# Altium schematic sheet WBR3-CS1239 V1.0.SchDoc
size A2; Parameter 1: 1.5C
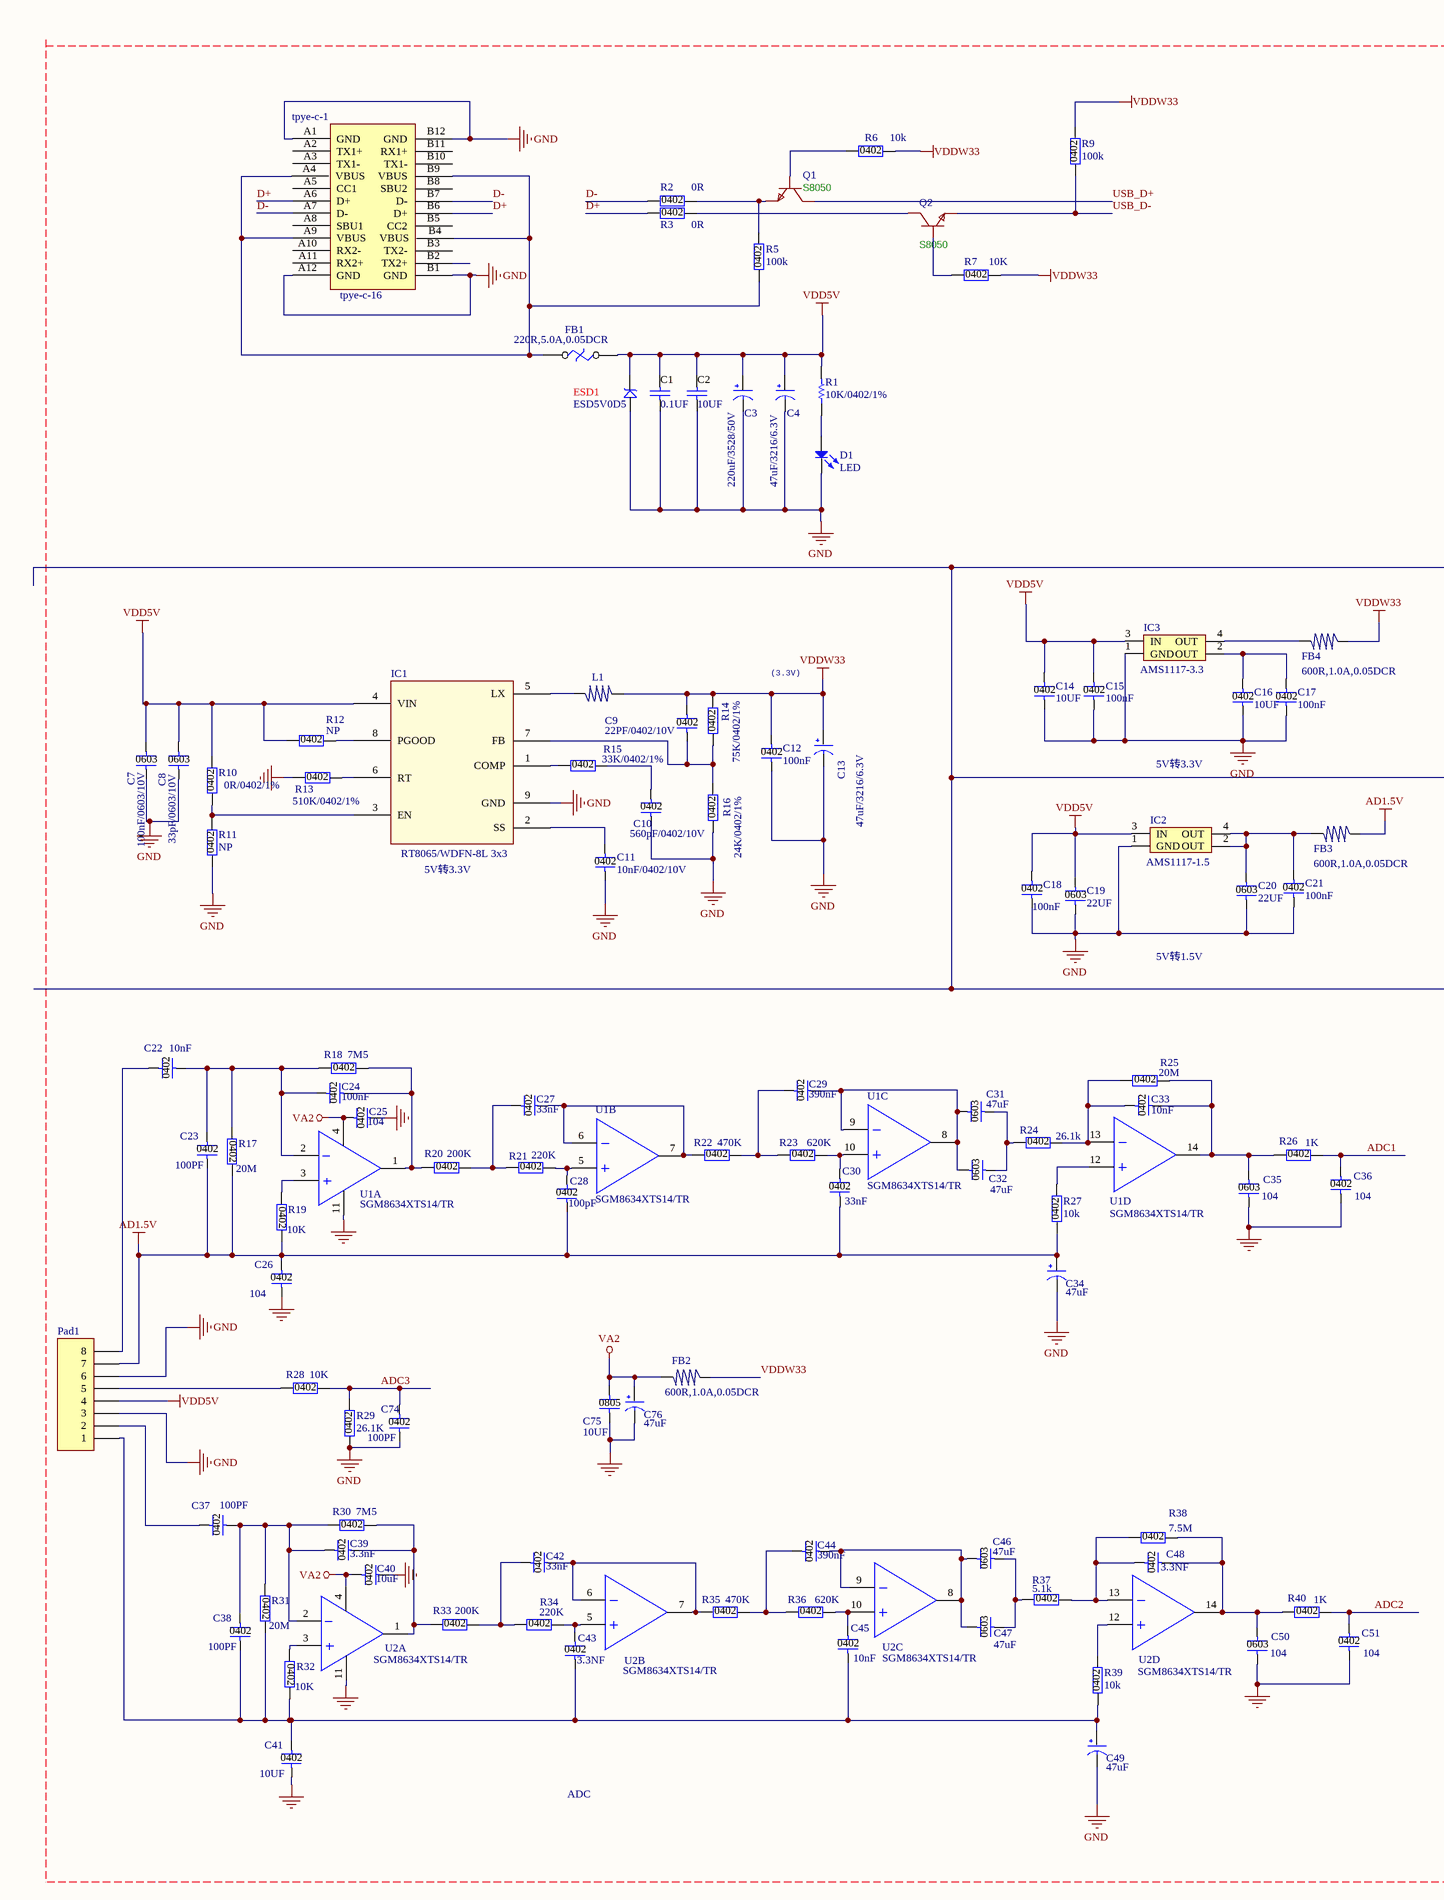
[diagram p0: WBR3-CS1239 V1.0.SchDoc, left]
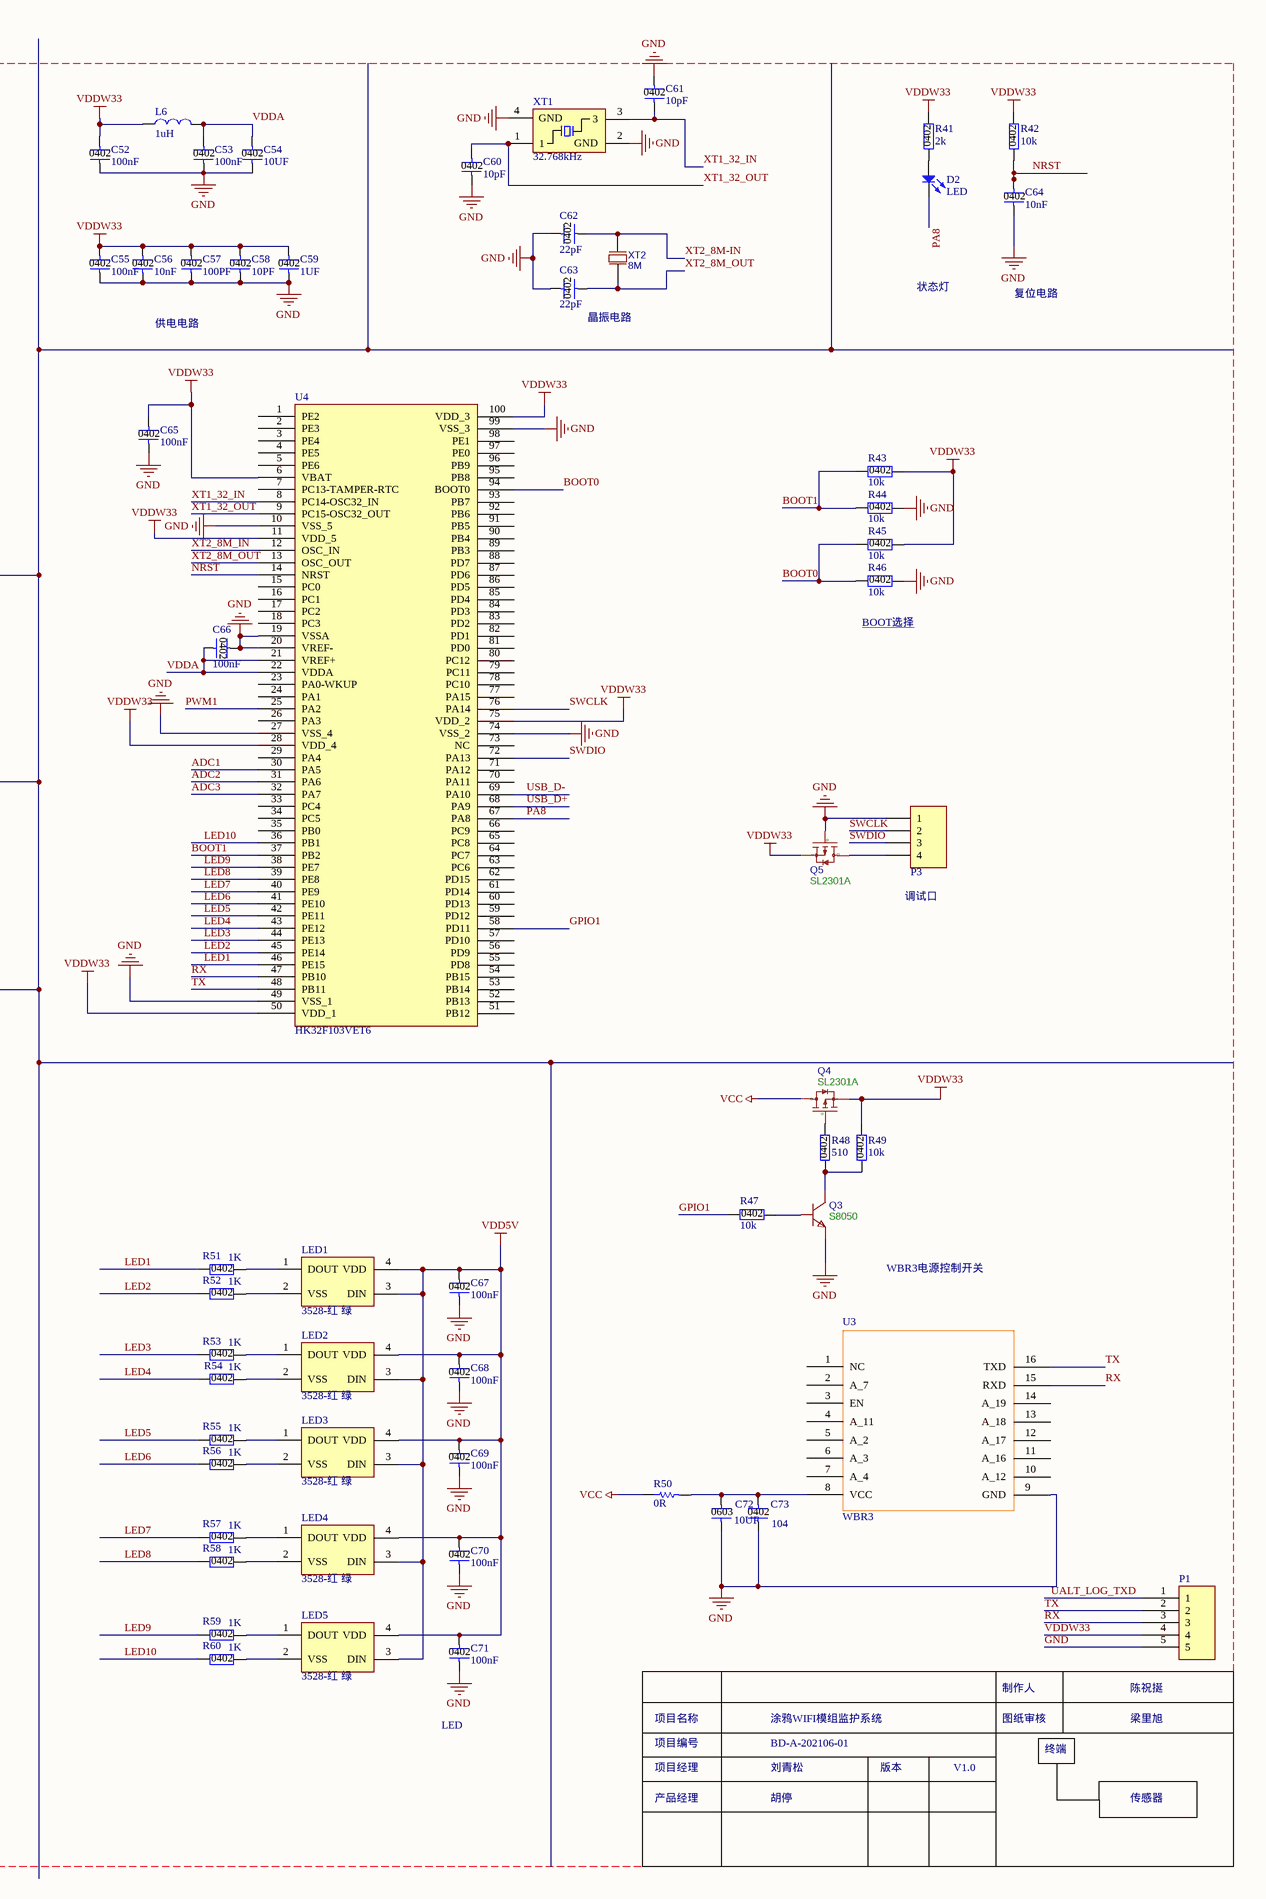
[diagram p1: WBR3-CS1239 V1.0.SchDoc, right]

## Parts
C1  0.1UF  [C0603]
C2  10UF  [C0603]
C3  220uF/3528/50V  [CCAPE-D]
C4  47uF/3216/6.3V  [TAJ-A]
C7  100nF/0603/10V  [C0603]
C8  33pF/0603/10V  [C0603]
C9  22PF/0402/10V  [C0402]
C10  560pF/0402/10V  [C0402]
C11  10nF/0402/10V  [C0402]
C12  100nF  [C0402]
C13  47uF/3216/6.3V  [TAJ-A]
C14  10UF  [C0402]
C15  100nF  [C0402]
C16  10UF  [C0402]
C17  100nF  [C0402]
C18  100nF  [C0402]
C19  22UF  [C0402]
C20  22UF  [C0402]
C21  100nF  [C0402]
C22  10nF  [C0402]
C23  100PF  [C0402]
C24  100nF  [C0402]
C25  104  [C0402]
C26  104  [C0402]
C27  33nF  [C0402]
C28  100pF  [C0402]
C29  390nF  [C0402]
C30  33nF  [C0402]
C31  47uF  [C0603]
C32  47uF  [C0603]
C33  10nF  [C0402]
C34  47uF  [TAJ-A]
C35  104  [C0603]
C36  104  [C0402]
C37  100PF  [C0402]
C38  100PF  [C0402]
C39  3.3nF  [C0402]
C40  10uF  [C0402]
C41  10UF  [C0402]
C42  33nF  [C0402]
C43  3.3NF  [C0402]
C44  390nF  [C0402]
C45  10nF  [C0402]
C46  47uF  [C0603]
C47  47uF  [C0603]
C48  3.3NF  [C0402]
C49  47uF  [TAJ-A]
C50  104  [C0603]
C51  104  [C0402]
C52  100nF  [C0402]
C53  100nF  [C0402]
C54  10UF  [C0402]
C55  100nF  [C0402]
C56  10nF  [C0402]
C57  100PF  [C0402]
C58  10PF  [C0402]
C59  1UF  [C0402]
C60  10pF  [C0402]
C61  10pF  [C0402]
C62  22pF  [C0402]
C63  22pF  [C0402]
C64  10nF  [C0402]
C65  100nF  [C0402]
C66  100nF  [C0402]
C67  100nF  [C0402]
C68  100nF  [C0402]
C69  100nF  [C0402]
C70  100nF  [C0402]
C71  100nF  [C0402]
C72  10UF  [C0603]
C73  104  [C0402]
C74  100PF  [C0402]
C75  10UF  [C0805]
C76  47uF  [TAJ-A]
D1  LED  [LED0805]
D2  LED  [LED0805]
ESD1  ESD5V0D5  [SMBJ5]
FB1  220R,5.0A,0.05DCR  [FB]
FB2  600R,1.0A,0.05DCR  [R0805]
FB3  600R,1.0A,0.05DCR  [R0805]
FB4  600R,1.0A,0.05DCR  [R0805]
IC1  RT8065/WDFN-8L 3x3  [WDFM]
IC2  AMS1117-1.5  [3.3V]
IC3  AMS1117-3.3  [3.3V]
L1  220R,2.0A,0.05DCR  [L2*2]  (value not drawn)
L6  1uH  [R0402]
LED1  3528-红 绿  [LED]
LED2  3528-红 绿  [LED]
LED3  3528-红 绿  [LED]
LED4  3528-红 绿  [LED]
LED5  3528-红 绿  [LED]
P1  (no value)
P3  Header 4  [HDR1X4]  (value not drawn)
Pad1  Header 8  [PJ12]  (value not drawn)
Q1  S8050  [SOT-23-3L]
Q2  S8050  [SOT-23-3L]
Q3  S8050  [SOT-23-3L]
Q4  SL2301A  [SOT-23R]
Q5  SL2301A  [SOT-23R]
R1  10K/0402/1%  [0402]
R2  0R  [R0402]
R3  0R  [R0402]
R5  100k  [R0402]
R6  10k  [R0402]
R7  10K  [R0402]
R9  100k  [R0402]
R10  0R/0402/1%  [R0402]
R11  NP  [R0402]
R12  NP  [R0402]
R13  510K/0402/1%  [R0402]
R14  75K/0402/1%  [R0402]
R15  33K/0402/1%  [R0402]
R16  24K/0402/1%  [R0402]
R17  20M  [R0402]
R18  7M5  [R0402]
R19  10K  [R0402]
R20  200K  [R0402]
R21  220K  [R0402]
R22  470K  [R0402]
R23  620K  [R0402]
R24  26.1k  [R0402]
R25  20M  [R0402]
R26  1K  [R0402]
R27  10k  [R0402]
R28  10K  [R0402]
R29  26.1K  [R0402]
R30  7M5  [R0402]
R31  20M  [R0402]
R32  10K  [R0402]
R33  200K  [R0402]
R34  220K  [R0402]
R35  470K  [R0402]
R36  620K  [R0402]
R37  5.1k  [R0402]
R38  7.5M  [R0402]
R39  10k  [R0402]
R40  1K  [R0402]
R41  2k  [R0402]
R42  10k  [R0402]
R43  10k  [R0402]
R44  10k  [R0402]
R45  10k  [R0402]
R46  10k  [R0402]
R47  10k  [R0402]
R48  510  [R0402]
R49  10k  [R0402]
R50  0R  [0402]
R51  1K  [R0402]
R52  1K  [R0402]
R53  1K  [R0402]
R54  1K  [R0402]
R55  1K  [R0402]
R56  1K  [R0402]
R57  1K  [R0402]
R58  1K  [R0402]
R59  1K  [R0402]
R60  1K  [R0402]
tpye-c-1  tpye-c-16  [TYPE-C_16P_SMT]
U1  SGM8634XTS14/TR  [SSOP-14]  (parts A,B,C,D of 4)
U2  SGM8634XTS14/TR  [SSOP-14]  (parts A,B,C,D of 4)
U3  WBR3
U4  HK32F103VET6
XT1  32.768kHz  [y1]
XT2  8M  [y2]

## Nets
AD1.5V: C23.2 C26.1 C28.2 C30.2 C34.1(VCC) FB3.1 Pad1.7 R17.2 R19.2 R27.1
GND: C1.1 C2.2 C3.2(GND) C4.2(GND) C7.2 C8.2 C10.2 C11.2 C12.2 C13.2(GND) C14.2 C15.2 C16.2 C17.2 C18.2 C19.2 C20.2 C21.2 C25.2 C26.2 C34.2(GND) C35.2 C36.2 C40.2 C41.2 C49.2(GND) C50.2 C51.2 C52.2 C53.2 C54.2 C55.2 C56.2 C57.2 C58.2 C59.2 C60.2 C61.1 C62.1 C63.1 C64.2 C65.2 C66.1 C67.2 C68.2 C69.2 C70.2 C71.2 C72.2 C73.2 C74.2 C75.2 C76.2(GND) D1.2(K) ESD1.1 IC1.9(GND) IC2.1(GND) IC3.1(GND) P1.5 P3.1 Pad1.3 Pad1.6 Q3.1(E) Q5.1(G) R11.1 R13.1 R16.1 R29.1 R44.2 R46.2 tpye-c-1.A1(GND) tpye-c-1.A12(GND) tpye-c-1.B1(GND) tpye-c-1.B12(GND) U1.11 U2.11 U3.9(GND) U4.10(VSS_5) U4.19(VSSA) U4.20(VREF-) U4.27(VSS_4) U4.49(VSS_1) U4.74(VSS_2) U4.99(VSS_3) XT1.2(GND) XT1.4(GND)
VA2: C25.1 C40.1 C75.1 C76.1(VCC) FB2.2 U1.4 U2.4
VCC: Q4.3(D) R50.1
VDD5V: C1.2 C2.1 C3.1(VCC) C4.1(VCC) C7.1 C8.1 C14.1 C15.1 C18.1 C19.1 C67.1 C68.1 C69.1 C70.1 C71.1 ESD1.2 FB1.2 IC1.4(VIN) IC2.3(IN) IC3.3(IN) LED1.3(DIN) LED1.4(VDD) LED2.3(DIN) LED2.4(VDD) LED3.3(DIN) LED3.4(VDD) LED4.3(DIN) LED4.4(VDD) LED5.3(DIN) LED5.4(VDD) Pad1.4 R1.2 R10.2 R12.1
VDDW33: C9.1 C12.1 C13.1(VCC) C52.1 C55.1 C56.1 C57.1 C58.1 C59.1 C65.1 FB2.1 FB4.1 L1.2 L6.2 P1.4 Q4.2(S) Q5.2(S) R6.2 R7.2 R9.2 R14.2 R41.2 R42.2 R43.2 R45.2 R49.2 U4.6(VBAT) U4.11(VDD_5) U4.28(VDD_4) U4.50(VDD_1) U4.75(VDD_2) U4.100(VDD_3)
ADC1: C36.1 R26.2 U4.30(PA5)
ADC2: C51.1 R40.2 U4.31(PA6)
ADC3: C74.1 R28.2 R29.2 U4.32(PA7)
BOOT0: R45.1 R46.1 U4.94(BOOT0)
BOOT1: R43.1 R44.1 U4.37(PB2)
D+: R3.1 tpye-c-1.A6(D+) tpye-c-1.B6(D+)
D-: R2.1 tpye-c-1.A7(D-) tpye-c-1.B7(D-)
GPIO1: R47.1 U4.58(PD11)
LED1: R51.1 U4.46(PE15)
LED2: R52.1 U4.45(PE14)
LED3: R53.1 U4.44(PE13)
LED4: R54.1 U4.43(PE12)
LED5: R55.1 U4.42(PE11)
LED6: R56.1 U4.41(PE10)
LED7: R57.1 U4.40(PE9)
LED8: R58.1 U4.39(PE8)
LED9: R59.1 U4.38(PE7)
LED10: R60.1 U4.36(PB1)
NRST: C64.1 R42.1 U4.14(NRST)
PA8: D2.2(K) U4.67(PA8)
PWM1: U4.25(PA2)
RX: P1.3 U3.15(RXD) U4.47(PB10)
SWCLK: P3.2 U4.76(PA14)
SWDIO: P3.3 U4.72(PA13)
TX: P1.2 U3.16(TXD) U4.48(PB11)
UALT_LOG_TXD: P1.1
USB_D+: Q1.3(C) U4.68(PA9)
USB_D-: Q2.1(E) R9.1 U4.69(PA10)
VDDA: C53.1 C54.1 C66.2 L6.1 U4.21(VREF+) U4.22(VDDA)
XT1_32_IN: C61.2 U4.8(PC14-OSC32_IN) XT1.3
XT1_32_OUT: C60.1 U4.9(PC15-OSC32_OUT) XT1.1
XT2_8M-IN: C62.2 XT2.2(OSC2)
XT2_8M_IN: U4.12(OSC_IN)
XT2_8M_OUT: C63.2 U4.13(OSC_OUT) XT2.1(OSC1)
NetC9_2: C9.2 IC1.7(FB) R14.1 R16.2
NetC10_1: C10.1 R15.2
NetC11_1: C11.1 IC1.2(SS)
NetC16_1: C16.1 C17.1 IC3.2(OUT)
NetC20_1: C20.1 C21.1 FB3.2 IC2.2(OUT) IC2.4(OUT)
NetC22_1: C22.1 Pad1.8
NetC22_2: C22.2 C23.1 C24.1 R17.1 R18.1 U1.2
NetC24_2: C24.2 R18.2 R20.1 U1.1
NetC27_1: C27.1 R20.2 R21.1
NetC27_2: C27.2 R22.1 U1.6 U1.7
NetC28_1: C28.1 R21.2 U1.5
NetC29_1: C29.1 R22.2 R23.1
NetC29_2: C29.2 C31.1 C32.1 U1.8 U1.9
NetC30_1: C30.1 R23.2 U1.10
NetC31_2: C31.2 C32.2 R24.1
NetC33_1: C33.1 R24.2 R25.1 U1.13
NetC33_2: C33.2 C35.1 R25.2 R26.1 U1.14
NetC37_1: C37.1 Pad1.2
NetC37_2: C37.2 C38.1 C39.1 R30.1 R31.1 U2.2
NetC38_2: C38.2 C41.1 C43.2 C45.2 C49.1(VCC) Pad1.1 R31.2 R32.2 R39.1
NetC39_2: C39.2 R30.2 R33.1 U2.1
NetC42_1: C42.1 R33.2 R34.1
NetC42_2: C42.2 R35.1 U2.6 U2.7
NetC43_1: C43.1 R34.2 U2.5
NetC44_1: C44.1 R35.2 R36.1
NetC44_2: C44.2 C46.1 C47.1 U2.8 U2.9
NetC45_1: C45.1 R36.2 U2.10
NetC46_2: C46.2 C47.2 R37.1
NetC48_1: C48.1 R37.2 R38.1 U2.13
NetC48_2: C48.2 C50.1 R38.2 R40.1 U2.14
NetC72_1: C72.1 C73.1 R50.2 U3.8(VCC)
NetD1_1: D1.1(A) R1.1
NetD2_1: D2.1(A) R41.1
NetFB1_1: FB1.1 R5.1 tpye-c-1.A4(VBUS) tpye-c-1.A9(VBUS) tpye-c-1.B4(VBUS) tpye-c-1.B9(VBUS)
NetFB4_2: FB4.2 IC3.4(OUT)
NetIC1_1: IC1.1(COMP) R15.1
NetIC1_3: IC1.3(EN) R10.1 R11.2
NetIC1_5: IC1.5(LX) L1.1
NetIC1_6: IC1.6(RT) R13.2
NetIC1_8: IC1.8(PGOOD) R12.2
NetLED1_1: LED1.1(DOUT) R51.2
NetLED1_2: LED1.2(VSS) R52.2
NetLED2_1: LED2.1(DOUT) R53.2
NetLED2_2: LED2.2(VSS) R54.2
NetLED3_1: LED3.1(DOUT) R55.2
NetLED3_2: LED3.2(VSS) R56.2
NetLED4_1: LED4.1(DOUT) R57.2
NetLED4_2: LED4.2(VSS) R58.2
NetLED5_1: LED5.1(DOUT) R59.2
NetLED5_2: LED5.2(VSS) R60.2
NetP3_4: P3.4 Q5.3(D)
NetPad1_5: Pad1.5 R28.1
NetQ1_1: Q1.1(E) R2.2 R5.2
NetQ1_2: Q1.2(B) R6.1
NetQ2_2: Q2.2(B) R7.1
NetQ2_3: Q2.3(C) R3.2
NetQ3_2: Q3.2(B) R47.2
NetQ3_3: Q3.3(C) R48.1 R49.1
NetQ4_1: Q4.1(G) R48.2
NetR19_1: R19.1 U1.3
NetR27_2: R27.2 U1.12
NetR32_1: R32.1 U2.3
NetR39_2: R39.2 U2.12

Not connected (* = marked no-connect by the designer): tpye-c-1 A2(TX1+) A3(TX1-) A5(CC1) A8(SBU1) A10(RX2-) A11(RX2+) B2(TX2+) B3(TX2-) B5(CC2) B8(SBU2) B10(TX1-) B11(RX1+); U3 1(NC) 2(A_7) 3(EN) 4(A_11) 5(A_2) 6(A_3) 7(A_4) 10(A_12) 11(A_16) 12(A_17) 13(A_18) 14(A_19); U4 1(PE2) 2(PE3) 3(PE4) 4(PE5) 5(PE6) 7(PC13-TAMPER-RTC) 15(PC0) 16(PC1) 17(PC2) 18(PC3) 23(PA0-WKUP) 24(PA1) 26(PA3) 29(PA4) 33(PC4) 34(PC5) 35(PB0) 51(PB12) 52(PB13) 53(PB14) 54(PB15) 55(PD8) 56(PD9) 57(PD10) 59(PD12) 60(PD13) 61(PD14) 62(PD15) 63(PC6) 64(PC7) 65(PC8) 66(PC9) 70(PA11) 71(PA12) 73(NC) 77(PA15) 78(PC10) 79(PC11) 80(PC12) 81(PD0) 82(PD1) 83(PD2) 84(PD3) 85(PD4) 86(PD5) 87(PD6) 88(PD7) 89(PB3) 90(PB4) 91(PB5) 92(PB6) 93(PB7) 95(PB8) 96(PB9) 97(PE0) 98(PE1)

## Notes on the sheet
- 状态灯
- 供电电路
- (near C63) 晶振电路
- 复位电路
- (near R46) BOOT选择
- (3.3V)
- 5V转3.3V
- (near IC1) 5V转3.3V
- (near P3) 调试口
- 5V转1.5V
- WBR3电源控制开关
- 制作人
- 陈祝挻
- LED
- 项目名称
- 项目编号
- 涂鸦WIFI模组监护系统
- BD-A-202106-01
- 图纸审核
- 终端
- 梁里旭
- ADC
- 项目经理
- 产品经理
- 刘青松
- 胡停
- 版本
- V1.0
- 传感器
- Title
- Size:
- Date:
- A4
- Number:
- Time:
- Revision:
- Sheet
- of
- File:
- (in symbol C0402) 0402
- (in symbol C0603) 0603
- (in symbol C0805) 0805
- (in symbol Cap4) 0402
- (in symbol Cap6) 0603
- (in symbol Cap0402) 0402
- (in symbol Cap0603) 0603
- (in symbol Res4) 0402
- (in symbol RES0402) 0402

## Library data of the parts
C1 C2 = C: 电容; Published: 8-Jun-2000; LatestRevisionDate: 17-Jul-2002; LatestRevisionNote: Re-released for DXP Platform.; PackageReference: RAD-0.3; Publisher: Altium Limited; PackageDescription: Radial Cap, Thru-Hole; 2 Leads; 0.3 in Pin Spacing; UnitPrice: 0.02
C3 C4 C13 C34 C49 C76 = C Pol: 极性电容
C7 C8 = C0603: 电容; Published: 8-Jun-2000; LatestRevisionDate: 17-Jul-2002; LatestRevisionNote: Re-released for DXP Platform.; PackageReference: RAD-0.3; Publisher: Altium Limited; PackageDescription: Radial Cap, Thru-Hole; 2 Leads; 0.3 in Pin Spacing; UnitPrice: 0.02
C9-C11 = C0402: 电容; Published: 8-Jun-2000; LatestRevisionDate: 17-Jul-2002; LatestRevisionNote: Re-released for DXP Platform.; PackageReference: RAD-0.3; Publisher: Altium Limited; PackageDescription: Radial Cap, Thru-Hole; 2 Leads; 0.3 in Pin Spacing; UnitPrice: 0.02
C12 C14-C18 C21 C52-C71 = Cap0402: 无极性贴片电容
C19 C20 = Cap0603: 无极性贴片电容
C22-C30 C33 C36-C45 C48 C51 C73 C74 = Cap4: 无极性贴片电容
C31 C32 C35 C46 C47 C50 C72 = Cap6: 无极性电容
C75 = C0805: 电容; Published: 8-Jun-2000; LatestRevisionDate: 17-Jul-2002; LatestRevisionNote: Re-released for DXP Platform.; PackageReference: RAD-0.3; Publisher: Altium Limited; PackageDescription: Radial Cap, Thru-Hole; 2 Leads; 0.3 in Pin Spacing; UnitPrice: 0.02
D1 D2 = LED: Typical RED, GREEN, YELLOW, AMBER GaAs LED; Published: 8-Jun-2000; LatestRevisionDate: 17-Jul-2002; LatestRevisionNote: Re-released for DXP Platform.; PackageDocument: Feb-2002; PackageReference: 3.2X1.6X1.1; Publisher: Altium Limited; UnitPrice: 0.05
ESD1 = D Schottky: 肖基特二极管
FB1 = F: 熔断开关
FB2-FB4 L1 = L-Beads: 磁珠
IC1 = RT8056
IC2 IC3 = AMS1117: 电源转换5Vto3.3V
L6 = 6.8UH: CL-NLFC3225-6R8
LED1-LED5 = SK6812--3535
P1 = Component_1
P3 = Header 4: Header, 4-Pin; LatestRevisionDate: 17-Jul-2002; LatestRevisionNote: Re-released for DXP Platform.; Publisher: Altium Limited
Pad1 = Header 8: Header, 8-Pin; LatestRevisionDate: 17-Jul-2002; LatestRevisionNote: Re-released for DXP Platform.; Publisher: Altium Limited
Q1-Q3 = S8050: BOM_Manufacturer: KEC; BOM_Manufacturer Part: 2n3904S-RTK/PS; SMT Type: SOT-23; Contributor: LCEDA_Lib; BOM_Supplier: LCSC; BOM_Supplier Part: C18536; spicePre: Q; spiceSymbolName: 2N3904(SOT-23)
Q4 Q5 = NCE3401AY: BOM_Manufacturer: Ncepower; Contributor: LCSC; BOM_Supplier: LCSC; BOM_Manufacturer Part: NCE3401AY; BOM_Supplier Part: C169815; BOM_JLCPCB Part Class: Extended Part; spicePre: Q; spiceSymbolName: NCE3401AY
R1 R10-R16 R27 R39 R50 = RES0402: 电阻; Published: 8-Jun-2000; LatestRevisionDate: 17-Jul-2002; LatestRevisionNote: Re-released for DXP Platform.; PackageReference: AXIAL-0.3; Publisher: Altium Limited; PackageDescription: Axial Device, Thru-Hole; 2 Leads; 0.3 in Pin Spacing
R2 R3 R5-R7 R9 R41-R49 = RES0402: 贴片电阻; Published: 8-Jun-2000; LatestRevisionDate: 17-Jul-2002; LatestRevisionNote: Re-released for DXP Platform.; PackageReference: AXIAL-0.3; Publisher: Altium Limited; PackageDescription: Axial Device, Thru-Hole; 2 Leads; 0.3 in Pin Spacing
R17-R26 R28-R38 R40 R51-R60 = Res4: R0402贴片电阻
tpye-c-1 = tpye-c
U1 U2 = SGM8634: SGM8634XTS14/TR  TSSOP-14
XT1 = SMD_4P: 4脚SMD无源晶振
XT2 = 32.768KHz: BOM_Manufacturer: Abracon LLC; BOM_Manufacturer Part: ABS07-32.768KHZ-T; nameAlias: Frequency; Contributor: LCSC; BOM_Supplier: LCSC; BOM_Supplier Part: C130253; spicePre: X; spiceSymbolName: ABS07-32.768KHZ-T